# EasyEDA schematic BLDC driver_2020-06-03_09-24-41.json
TITLE: SENSORED BLDC; REV: 1.0; Date: 2020-06-02; Sheet: 1/1; Drawn By: agshin
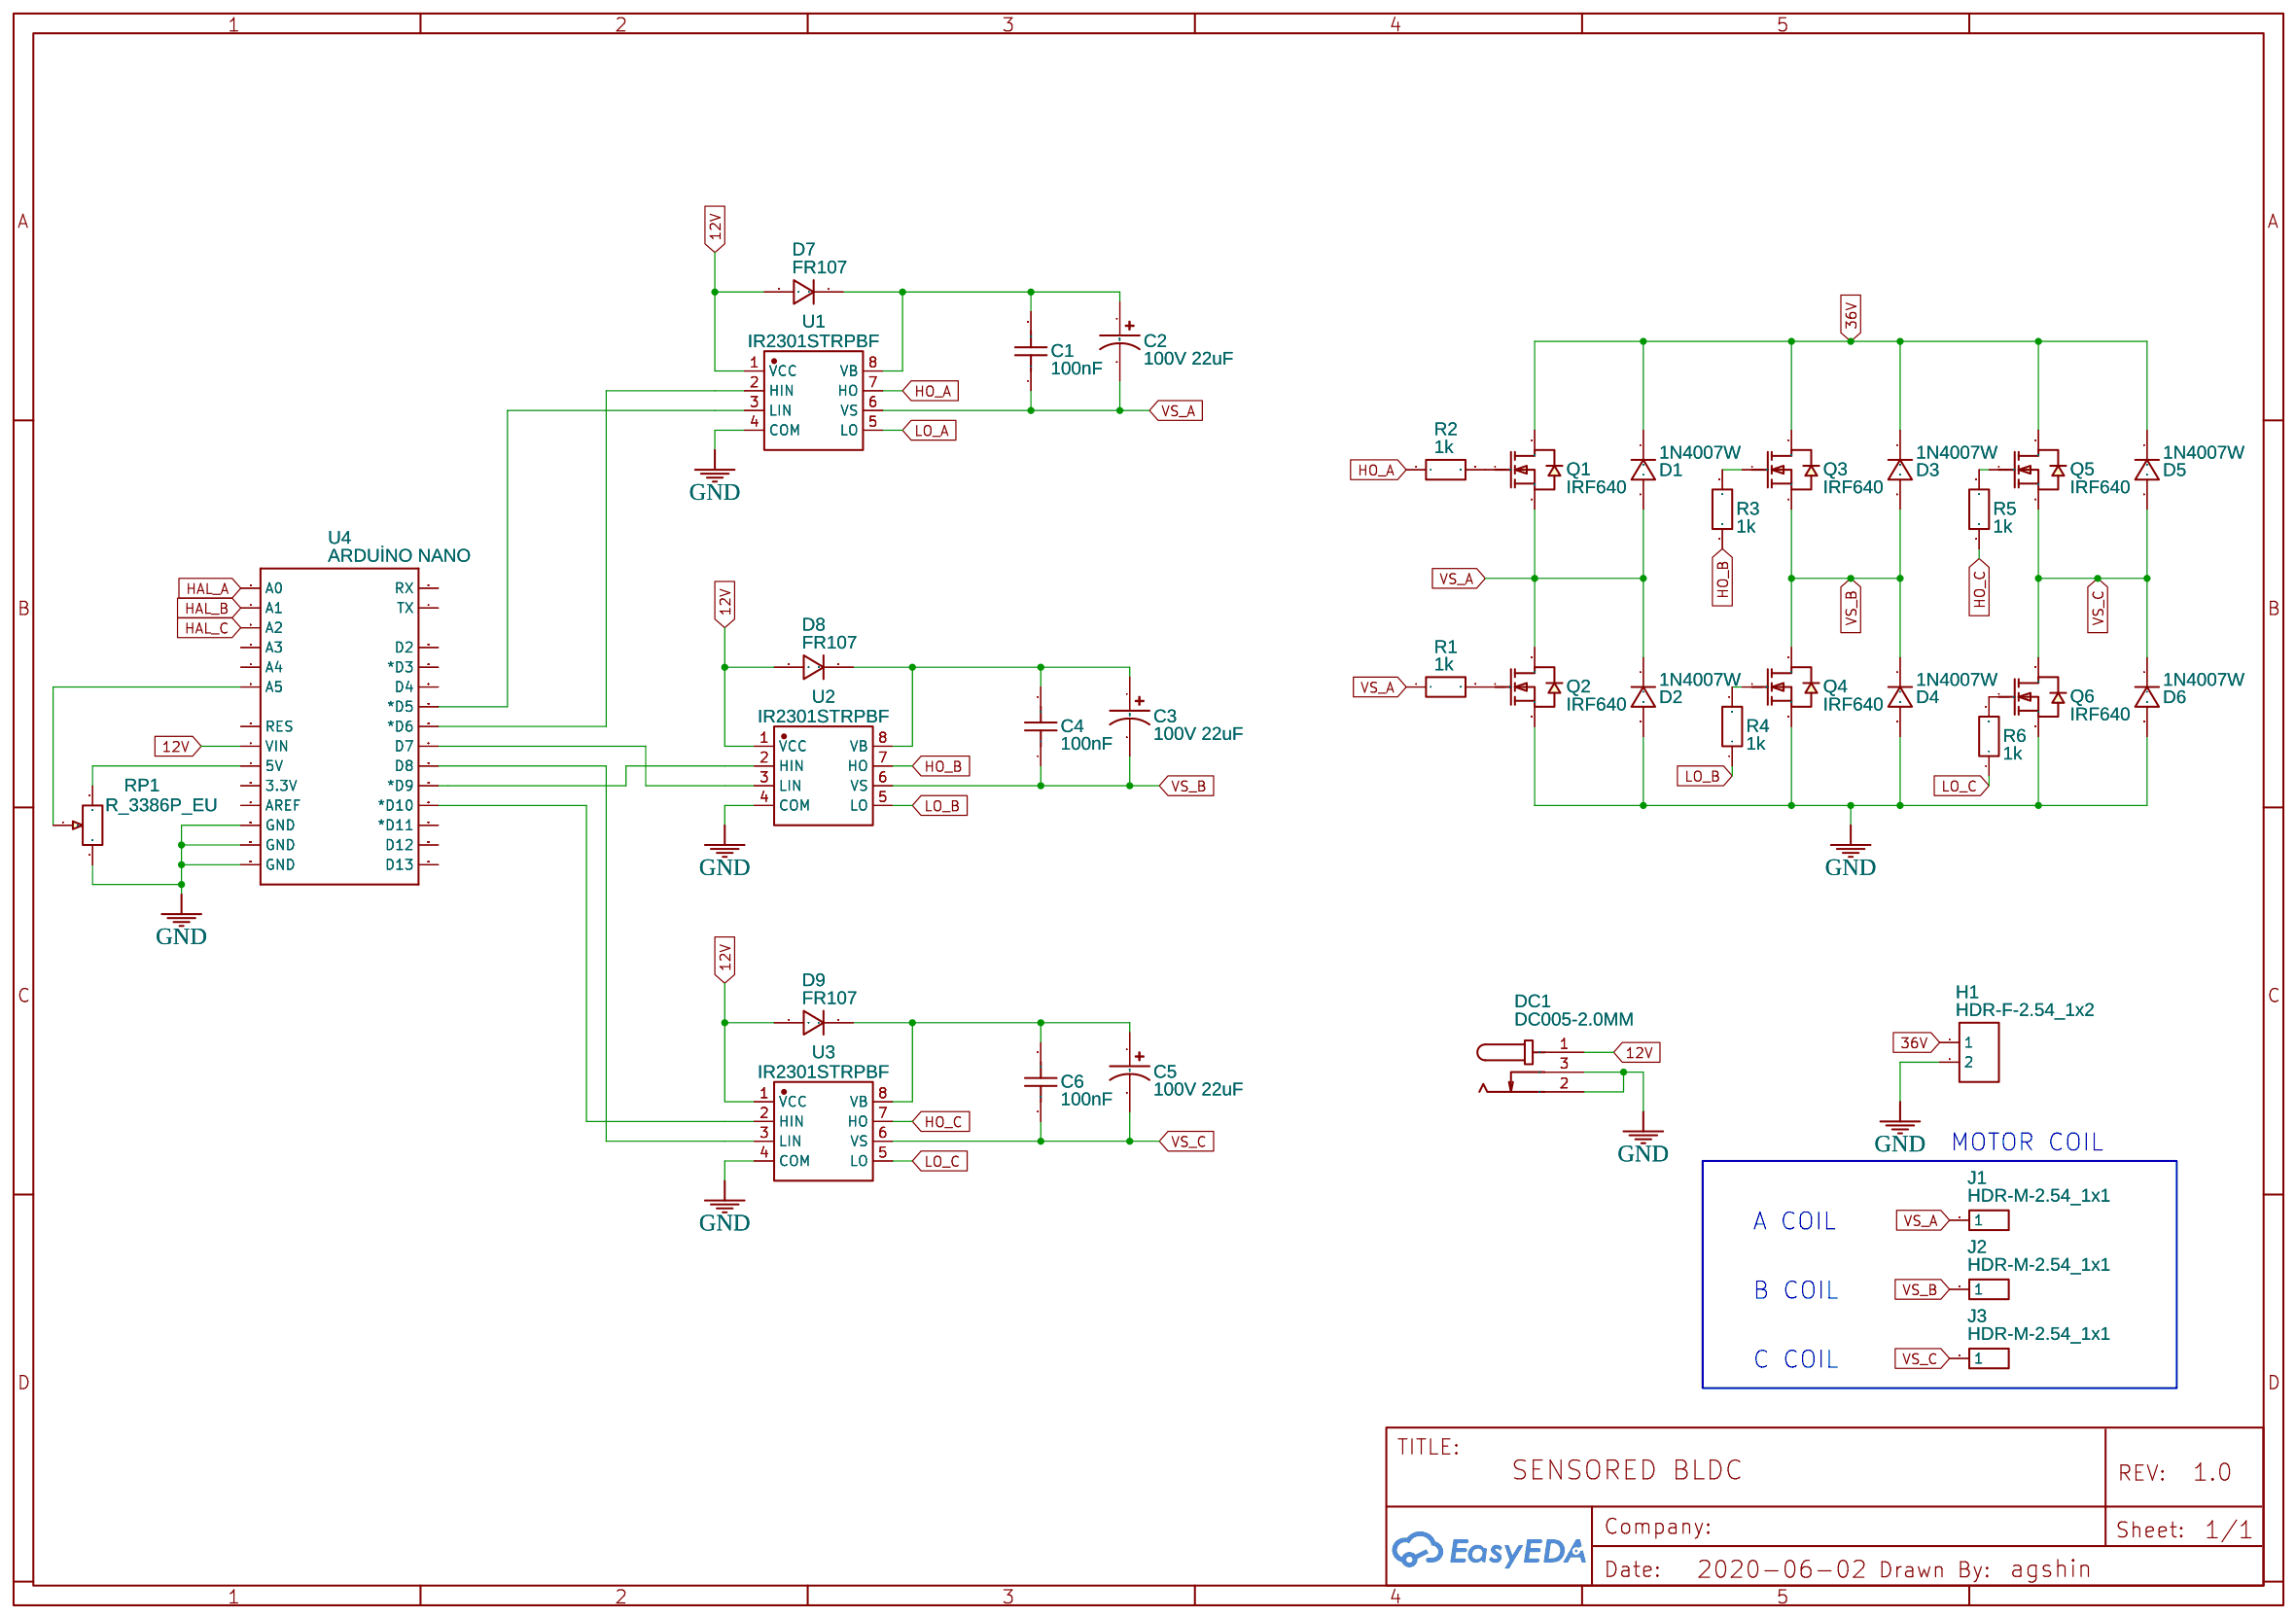
[diagram p0: schematic sheet]

## Parts
C1  100nF  [C0201]
C2  100V 22uF  [CASE-A_3216]
C3  100V 22uF  [CASE-A_3216]
C4  100nF  [C0201]
C5  100V 22uF  [CASE-A_3216]
C6  100nF  [C0201]
D1  1N4007W  [SOD-123_L2.8-W1.8-LS3.7-RD]
D2  1N4007W  [SOD-123_L2.8-W1.8-LS3.7-RD]
D3  1N4007W  [SOD-123_L2.8-W1.8-LS3.7-RD]
D4  1N4007W  [SOD-123_L2.8-W1.8-LS3.7-RD]
D5  1N4007W  [SOD-123_L2.8-W1.8-LS3.7-RD]
D6  1N4007W  [SOD-123_L2.8-W1.8-LS3.7-RD]
D7  FR107  [SOD-123_L2.8-W1.8-LS3.7-RD]
D8  FR107  [SOD-123_L2.8-W1.8-LS3.7-RD]
D9  FR107  [SOD-123_L2.8-W1.8-LS3.7-RD]
DC1  DC005-2.0MM  [DC-IN-TH_DC005]
H1  HDR-F-2.54_1x2  [HDR-F-2.54_1X2]
J1  HDR-M-2.54_1x1  [HDR-M-2.54_1X1]
J2  HDR-M-2.54_1x1  [HDR-M-2.54_1X1]
J3  HDR-M-2.54_1x1  [HDR-M-2.54_1X1]
Q1  IRF640  [SOT-23_L2.9-W1.3-P0.95-LS2.4-BR]
Q2  IRF640  [SOT-23_L2.9-W1.3-P0.95-LS2.4-BR]
Q3  IRF640  [SOT-23_L2.9-W1.3-P0.95-LS2.4-BR]
Q4  IRF640  [SOT-23_L2.9-W1.3-P0.95-LS2.4-BR]
Q5  IRF640  [SOT-23_L2.9-W1.3-P0.95-LS2.4-BR]
Q6  IRF640  [SOT-23_L2.9-W1.3-P0.95-LS2.4-BR]
R1  1k  [R0201]
R2  1k  [R0201]
R3  1k  [R0201]
R4  1k  [R0201]
R5  1k  [R0201]
R6  1k  [R0201]
RP1  R_3386P_EU  [RES-ADJ-TH_3386P]
U1  IR2301STRPBF  [SOIC-8_L5.0-W4.0-P1.27-LS6.0-BL]
U2  IR2301STRPBF  [SOIC-8_L5.0-W4.0-P1.27-LS6.0-BL]
U3  IR2301STRPBF  [SOIC-8_L5.0-W4.0-P1.27-LS6.0-BL]
U4  ARDUİNO NANO  [DUEMILANOVE_VIAS]

## Library data of the parts
C1 C4 C6 = C_0201_US: Contributor: LCEDA_Lib
C2 C3 C5 = C_Tan_SMD_A_US: Contributor: LCEDA_Lib
D1-D9 = 1N4007W: Supplier: LCSC; Supplier Part: C328592; Manufacturer: BLUE ROCKET; Contributor: LCEDA_Lib
DC1 = DC005-2.0MM: Supplier: LCSC; Manufacturer: SOFNG; Supplier Part: C111567
H1 = HDR-F-2.54_1x2: Supplier Part: C49661; Supplier: LCSC; Contributor: LCEDA_Lib
J1-J3 = HDR-M-2.54_1x1: Supplier Part: C81276; Supplier: LCSC; Contributor: LCEDA_Lib
Q1-Q6 = 2N7002: Supplier: LCSC; Manufacturer: Nexperia; Manufacturer Part: 2N7002,215; image: //image.lceda.cn/szlcsc/C65189.jpg; Supplier Part: C65189; LCSC Assembly: Yes; SMT Type: Extend; Contributor: LCEDA_Lib
R1-R6 = R_0201_EU: Contributor: LCEDA_Lib
RP1 = R_3386P_EU: Supplier: LCSC; Contributor: LCEDA_Lib; Value(Ω): 10K
U1-U3 = IR2301STRPBF: Supplier: LCSC; Supplier Part: C413500; Manufacturer: Infineon Technologies; Contributor: LCSC; LCSC Assembly: Yes; SMT Type: Extend
U4 = ARDUINO_SHIELDNO_SILK: Arduino shield footprint; Contributor: SparkFun

## Nets
12V: D7.2 D8.2 D9.2 DC1.1 U1.1(VCC) U2.1(VCC) U3.1(VCC) U4.VIN
36V: D1.1 D3.1 D5.1 H1.1 Q1.3(D) Q3.3(D) Q5.3(D)
GND: D2.2 D4.2 D6.2 DC1.2 DC1.3 H1.2 Q2.2(S) Q4.2(S) Q6.2(S) RP1.1 U1.4(COM) U2.4(COM) U3.4(COM) U4.GND@0(GND) U4.GND@1(GND) U4.GND@2(GND)
HAL_A: U4.A0
HAL_B: U4.A1
HAL_C: U4.A2
HO_A: R2.1 U1.7(HO)
HO_B: R3.1 U2.7(HO)
HO_C: R5.1 U3.7(HO)
LO_A: U1.5(LO)
LO_B: R4.1 U2.5(LO)
LO_C: R6.1 U3.5(LO)
VS_A: C1.1 C2.2 D1.2 D2.1 J1.1 Q1.2(S) Q2.3(D) R1.1 U1.6(VS)
VS_B: C3.2 C4.1 D3.2 D4.1 J2.1 Q3.2(S) Q4.3(D) U2.6(VS)
VS_C: C5.2 C6.1 D5.2 D6.1 J3.1 Q5.2(S) Q6.3(D) U3.6(VS)
Net-(C1-2): C1.2 C2.1 D7.1 U1.8(VB)
Net-(C3-1): C3.1 C4.2 D8.1 U2.8(VB)
Net-(C5-1): C5.1 C6.2 D9.1 U3.8(VB)
Net-(Q1-1): Q1.1(G) R2.2
Net-(Q2-1): Q2.1(G) R1.2
Net-(Q3-1): Q3.1(G) R3.2
Net-(Q4-1): Q4.1(G) R4.2
Net-(Q5-1): Q5.1(G) R5.2
Net-(Q6-1): Q6.1(G) R6.2
Net-(RP1-2): RP1.2 U4.A5
Net-(RP1-3): RP1.3 U4.5V
Net-(U1-2): U1.2(HIN) U4.D6(*D6)
Net-(U1-3): U1.3(LIN) U4.D5(*D5)
Net-(U2-2): U2.2(HIN) U4.D9(*D9)
Net-(U2-3): U2.3(LIN) U4.D7
Net-(U3-2): U3.2(HIN) U4.D10(*D10)
Net-(U3-3): U3.3(LIN) U4.D8

Not connected (* = marked no-connect by the designer): U4 3.3V A3 A4 AREF D2 D3(*D3) D4 D11(*D11) D12 D13 RES RX TX

## Notes on the sheet
- MOTOR COIL
- A COIL
- B COIL
- C COIL
